# Altium schematic sheet Controller.SchDoc
size A; SheetNumber: 1; SheetTotal: 1
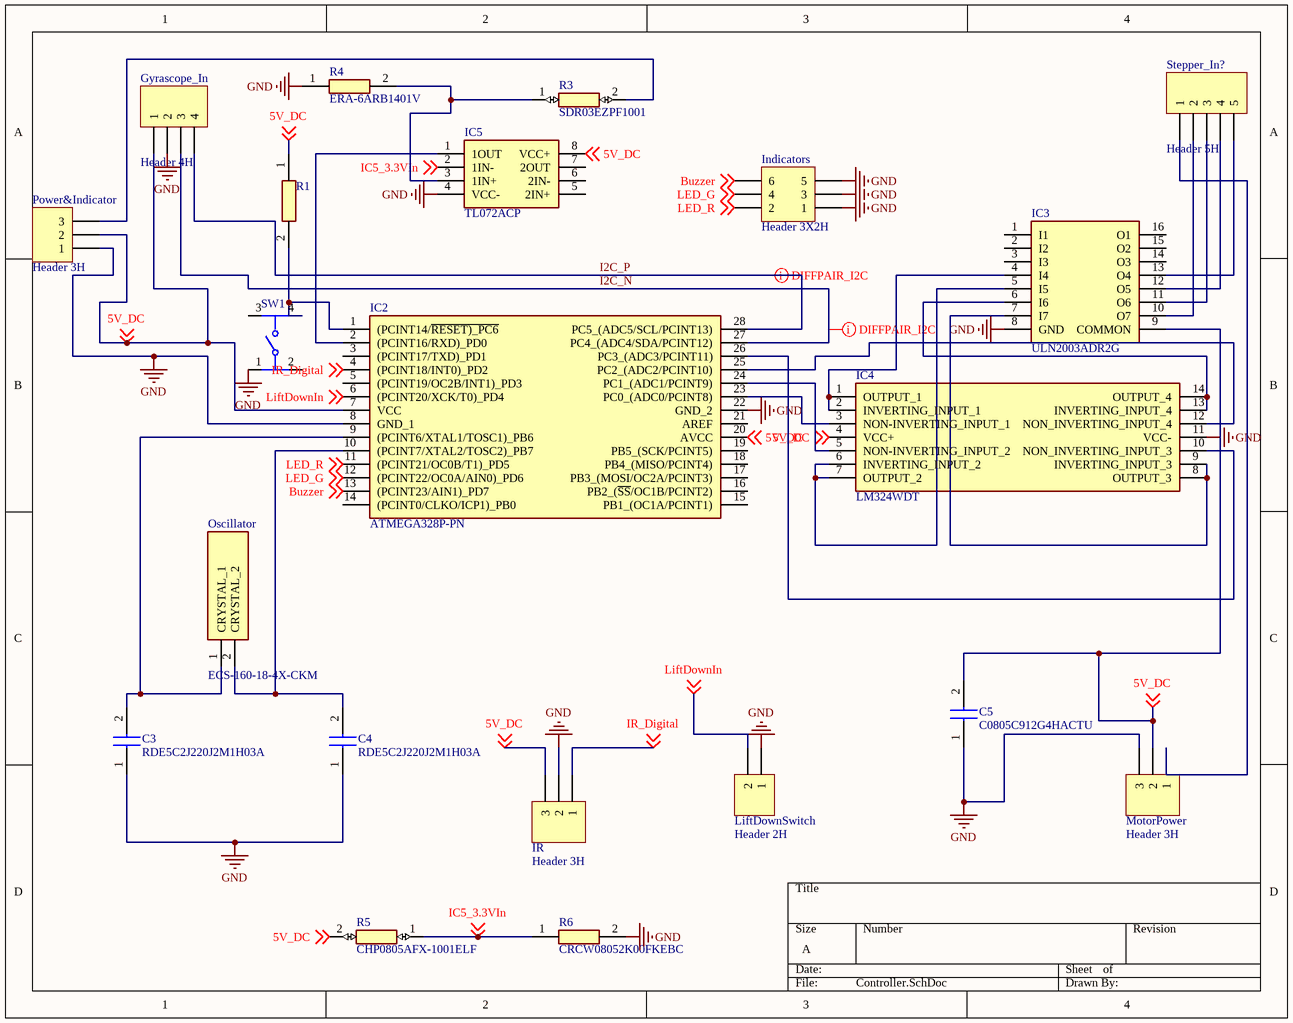
[diagram p0: Controller.SchDoc]

## Parts
C3  RDE5C2J220J2M1H03A  [RCE5C1H104J2A2H03B]
C4  RDE5C2J220J2M1H03A  [RCE5C1H104J2A2H03B]
C5  C0805C912G4HACTU  [CAPC2012X88N]
Gyrascope_In  Header 4H  [HDR1X4H]
IC2  ATMEGA328P-PN  [DIP794W53P254L3467H457Q28N]
IC3  ULN2003ADR2G  [SOIC127P600X175-16N]
IC4  LM324WDT  [SOIC127P600X175-14N]
IC5  TL072ACP  [DIP794W53P254L959H508Q8N]
Indicators  Header 3X2H  [HDR2X3H]
IR  Header 3H  [HDR1X3H]
LiftDownSwitch  Header 2H  [HDR1X2H]
MotorPower  Header 3H  [HDR1X3H]
Oscillator  ECS-160-18-4X-CKM  [ECS160184XCKM]
Power&Indicator  Header 3H  [HDR1X3H]
R1  (no value)  [RESC2012X60N]
R3  SDR03EZPF1001  [RESC1608X55N]
R4  ERA-6ARB1401V  [ERA6A_(0805)]
R5  CHP0805AFX-1001ELF  [RESC2012X60N]
R6  CRCW08052K00FKEBC  [RESC2012X50N]
Stepper_In?  Header 5H  [HDR1X5H]
SW1  (no value)  [FP-2-1825910-6-MFG]

## Nets
GND: C3.1 C4.1 C5.1 Gyrascope_In.2 IC2.8(GND_1) IC2.22(GND_2) IC3.8(GND) IC4.11(VCC-) IC5.4(VCC-) Indicators.1 Indicators.3 Indicators.5 IR.2 LiftDownSwitch.1 MotorPower.3 Power&Indicator.1 R4.1 R6.2 SW1.1
5V_DC: C5.2 Gyrascope_In.1 IC2.7(VCC) IC2.20(AVCC) IC3.9(COMMON) IC4.4(VCC+) IC5.8(VCC+) IR.3 MotorPower.2 Power&Indicator.2 R1.1 R5.2 ; off-sheet 5V_DC
Buzzer: IC2.13((PCINT23/AIN1)_PD7) Indicators.6 ; off-sheet Buzzer
I2C_N: Gyrascope_In.3 IC2.27(PC4_(ADC4/SDA/PCINT12))
I2C_P: Gyrascope_In.4 IC2.28(PC5_(ADC5/SCL/PCINT13))
IC5_3.3VIn: IC5.2(1IN-) R5.1 R6.1 ; off-sheet IC5_3.3VIn
IR_Digital: IC2.4((PCINT18/INT0)_PD2) IR.1 ; off-sheet IR_Digital
LED_G: IC2.12((PCINT22/OC0A/AIN0)_PD6) Indicators.4 ; off-sheet LED_G
LED_R: IC2.11((PCINT21/OC0B/T1)_PD5) Indicators.2 ; off-sheet LED_R
LiftDownIn: IC2.6((PCINT20/XCK/T0)_PD4) LiftDownSwitch.2 ; off-sheet LiftDownIn
NetC3_2: C3.2 IC2.9((PCINT6/XTAL1/TOSC1)_PB6) Oscillator.1(CRYSTAL_1)
NetC4_2: C4.2 IC2.10((PCINT7/XTAL2/TOSC2)_PB7) Oscillator.2(CRYSTAL_2)
NetIC2_1: IC2.1((PCINT14/~{RESET)_PC6}) R1.2 SW1.4
NetIC2_2: IC2.2((PCINT16/RXD)_PD0) IC5.1(1OUT)
NetIC2_23: IC2.23(PC0_(ADC0/PCINT8)) IC4.3(NON-INVERTING_INPUT_1)
NetIC2_24: IC2.24(PC1_(ADC1/PCINT9)) IC4.5(NON-INVERTING_INPUT_2)
NetIC2_25: IC2.25(PC2_(ADC2/PCINT10)) IC4.12(NON_INVERTING_INPUT_4)
NetIC2_26: IC2.26(PC3_(ADC3/PCINT11)) IC4.10(NON_INVERTING_INPUT_3)
NetIC3_4: IC3.4(I4) IC4.1(OUTPUT_1) IC4.2(INVERTING_INPUT_1)
NetIC3_5: IC3.5(I5) IC4.6(INVERTING_INPUT_2) IC4.7(OUTPUT_2)
NetIC3_6: IC3.6(I6) IC4.13(INVERTING_INPUT_4) IC4.14(OUTPUT_4)
NetIC3_7: IC3.7(I7) IC4.8(OUTPUT_3) IC4.9(INVERTING_INPUT_3)
NetIC3_10: IC3.10(O7) Stepper_In?.2
NetIC3_11: IC3.11(O6) Stepper_In?.3
NetIC3_12: IC3.12(O5) Stepper_In?.4
NetIC3_13: IC3.13(O4) Stepper_In?.5
NetIC5_3: IC5.3(1IN+) R3.1 R4.2
NetMotorPower_1: MotorPower.1 Stepper_In?.1
NetPower&Indicator_3: Power&Indicator.3 R3.2

Not connected (* = marked no-connect by the designer): IC2 3((PCINT17/TXD)_PD1) 5((PCINT19/OC2B/INT1)_PD3) 14((PCINT0/CLKO/ICP1)_PB0) 15(PB1_(OC1A/PCINT1)) 16(PB2_(~{SS}/OC1B/PCINT2)) 17(PB3_(MOSI/OC2A/PCINT3)) 18(PB4_(MISO/PCINT4)) 19(PB5_(SCK/PCINT5)) 21(AREF); IC3 1(I1) 2(I2) 3(I3) 14(O3) 15(O2) 16(O1); IC5 5(2IN+) 6(2IN-) 7(2OUT); SW1 2 3

## Layout directives
differential pair; differential pair class I2C: I2C_N, I2C_P

## Library data of the parts
C3 C4 = RDE5C2J220J2M1H03A: Capacitor; Manufacturer_Name: Murata Electronics; Datasheet Link: https://psearch.en.murata.com/capacitor/product/RDE5C2J220J2M1H03A.html; Height: 5.5mm; Manufacturer_Part_Number: RDE5C2J220J2M1H03A; Mouser Part Number: 81-RDE5C2J220J2M1H3A; Mouser Price/Stock: https://www.mouser.co.uk/ProductDetail/Murata-Electronics/RDE5C2J220J2M1H03A?qs=5aG0NVq1C4wmVHtRKJ01XA%3D%3D
C5 = C0805C912G4HACTU: Capacitor; Manufacturer_Name: Kemet; Datasheet Link: https://www.kemet.com/specsheet/C0805C912G4HACTU; Height: 0.88mm; Manufacturer_Part_Number: C0805C912G4HACTU; Mouser Part Number: 80-C0805C912G4HACTU; Mouser Price/Stock: https://www.mouser.co.uk/ProductDetail/KEMET/C0805C912G4HACTU?qs=W0yvOO0ixfHJmyB%252BYCP7IQ%3D%3D
Gyrascope_In = Header 4H: Header, 4-Pin, Right Angle; LatestRevisionDate: 17-Jul-2002; LatestRevisionNote: Re-released for DXP Platform.; Publisher: Altium Limited
IC2 = ATMEGA328P-PN: Integrated Circuit; Manufacturer_Name: Microchip; Datasheet Link: https://datasheet.datasheetarchive.com/originals/distributors/Datasheets_SAMA/81e6b951babeaaddc9de6b0e081ba8bf.pdf; Height: 4.572mm; Manufacturer_Part_Number: ATMEGA328P-PN; Mouser Part Number: 556-ATMEGA328P-PN; Mouser Price/Stock: https://www.mouser.co.uk/ProductDetail/Microchip-Technology-Atmel/ATMEGA328P-PN?qs=6Dg1WZIWLC4IRXxsq4v5tA%3D%3D; Arrow Part Number: ATMEGA328P-PN; Arrow Price/Stock: https://www.arrow.com/en/products/atmega328p-pn/microchip-technology?region=nac
IC3 = ULN2003ADR2G: Integrated Circuit; Manufacturer_Name: ON Semiconductor; Datasheet Link: http://www.onsemi.com/pub/Collateral/ULN2003A-D.PDF; Height: 1.75mm; Manufacturer_Part_Number: ULN2003ADR2G; Mouser Part Number: 863-ULN2003ADR2G; Mouser Price/Stock: https://www.mouser.co.uk/ProductDetail/onsemi/ULN2003ADR2G?qs=t2BMfLoP1KRgd83C6tnDAg%3D%3D; Arrow Part Number: ULN2003ADR2G; Arrow Price/Stock: https://www.arrow.com/en/products/uln2003adr2g/on-semiconductor?region=europe
IC4 = LM324WDT: Integrated Circuit; Manufacturer_Name: STMicroelectronics; Datasheet Link: https://co.mouser.com/datasheet/2/389/lm224a-1849701.pdf; Height: 1.75mm; Manufacturer_Part_Number: LM324WDT; Mouser Part Number: 511-LM324WDT; Mouser Price/Stock: https://www.mouser.co.uk/ProductDetail/STMicroelectronics/LM324WDT?qs=sjzR5wbTsNodE9OFOWodlw%3D%3D
IC5 = TL072ACP: Integrated Circuit; Manufacturer_Name: Texas Instruments; Datasheet Link: http://www.ti.com/lit/ds/symlink/tl071a.pdf; Height: 5.08mm; Manufacturer_Part_Number: TL072ACP; Mouser Part Number: 595-TL072ACP; Mouser Price/Stock: https://www.mouser.co.uk/ProductDetail/Texas-Instruments/TL072ACP?qs=0OT4q4QBUTLFvIZ%252B%2FvrwoQ%3D%3D; Arrow Part Number: TL072ACP; Arrow Price/Stock: https://www.arrow.com/en/products/tl072acp/texas-instruments?region=nac
Indicators = Header 3X2H: Header, 3-Pin, Dual row, Right Angle; LatestRevisionDate: 17-Jul-2002; LatestRevisionNote: Re-released for DXP Platform.; Publisher: Altium Limited
IR MotorPower Power&Indicator = Header 3H: Header, 3-Pin, Right Angle; LatestRevisionDate: 17-Jul-2002; LatestRevisionNote: Re-released for DXP Platform.; Publisher: Altium Limited
LiftDownSwitch = Header 2H: Header, 2-Pin, Right Angle; LatestRevisionDate: 17-Jul-2002; LatestRevisionNote: Re-released for DXP Platform.; Publisher: Altium Limited
Oscillator = ECS-160-18-4X-CKM: Crystal or Oscillator; Manufacturer_Name: ECS; Datasheet Link: https://www.mouser.be/datasheet/2/122/hc-49usx-791.pdf; Height: 3.5mm; Manufacturer_Part_Number: ECS-160-18-4X-CKM; Mouser Part Number: 520-ECS160-18-4X-CKM; Mouser Price/Stock: https://www.mouser.co.uk/ProductDetail/ECS/ECS-160-18-4X-CKM?qs=7MVldsJ5UawYqyimirccKw%3D%3D; Arrow Part Number: ECS-160-18-4X-CKM; Arrow Price/Stock: https://www.arrow.com/en/products/ecs-160-18-4x-ckm/ecs-international?region=nac
R1 = CHP0805-FX-1002ELF: Resistor; Manufacturer_Name: Bourns; Datasheet Link: https://ms.componentsearchengine.com/Datasheets/1/CHP0805-FX-1002ELF.pdf; Height: 0.6mm; Manufacturer_Part_Number: CHP0805-FX-1002ELF; Mouser Part Number: 652-CHP0805FX1002ELF; Mouser Price/Stock: https://www.mouser.co.uk/ProductDetail/Bourns/CHP0805-FX-1002ELF?qs=lc2O%252BfHJPVaDI6gsPdDtfw%3D%3D
R3 = SDR03EZPF1001: Resistor; Manufacturer_Name: ROHM Semiconductor; Datasheet Link: https://mouser.componentsearchengine.com/Datasheets/1/SDR03EZPF1001.pdf; Height: 0.55mm; Manufacturer_Part_Number: SDR03EZPF1001; Mouser Part Number: 755-SDR03EZPF1001; Mouser Price/Stock: https://www.mouser.co.uk/ProductDetail/ROHM-Semiconductor/SDR03EZPF1001?qs=byeeYqUIh0NXXxDsimC7bA%3D%3D
R4 = ERA-6ARB1401V: Resistor; Manufacturer_Name: Panasonic; Datasheet Link: http://industrial.panasonic.com/cdbs/www-data/pdf/RDM0000/AOA0000C307.pdf; Height: 0.6mm; Manufacturer_Part_Number: ERA-6ARB1401V; Mouser Part Number: 667-ERA-6ARB1401V; Mouser Price/Stock: https://www.mouser.com/Search/Refine.aspx?Keyword=667-ERA-6ARB1401V
R5 = CHP0805AFX-1001ELF: Resistor; Manufacturer_Name: Bourns; Datasheet Link: https://www.mouser.com/datasheet/2/54/chp-a-1858677.pdf; Height: 0.6mm; Manufacturer_Part_Number: CHP0805AFX-1001ELF; Mouser Part Number: 652-CHP0805AFX1001EL; Mouser Price/Stock: https://www.mouser.co.uk/ProductDetail/Bourns/CHP0805AFX-1001ELF?qs=BJlw7L4Cy7%2F%2FdiZX3l7oWQ%3D%3D; Arrow Part Number: CHP0805AFX-1001ELF; Arrow Price/Stock: https://www.arrow.com/en/products/chp0805afx-1001elf/bourns?region=nac
R6 = CRCW08052K00FKEBC: Resistor; Manufacturer_Name: Vishay; Datasheet Link: https://www.arrow.com/en/products/crcw08052k00fkebc/vishay?region=nac; Height: 0.5mm; Manufacturer_Part_Number: CRCW08052K00FKEBC; Mouser Part Number: 71-CRCW08052K00FKEBC; Mouser Price/Stock: https://www.mouser.co.uk/ProductDetail/Vishay-Dale/CRCW08052K00FKEBC?qs=wd5RIQLrsJimvZ2z7rs9jQ%3D%3D; Arrow Part Number: CRCW08052K00FKEBC; Arrow Price/Stock: https://www.arrow.com/en/products/crcw08052k00fkebc/vishay?region=nac
Stepper_In? = Header 5H: Header, 5-Pin, Right Angle; LatestRevisionDate: 17-Jul-2002; LatestRevisionNote: Re-released for DXP Platform.; Publisher: Altium Limited
SW1 = CMP-03407-000025-1: SWITCH TACTILE SPST-NO 0.05A 24V; Max Current Rating: 50mA; Actuator Type: Standard; Illumination Type: Non-Illuminated; Actuator Material: Nylon; Throw Configuration: SPST; Actuator Length: 0.37inch; Operating Force: 100gf; Switch Function: Off-Mom; Mechanical Life: 100000Cycles; Actuator Color: Brown; Switch Travel: 0.25mm; Packaging: Loose Piece; Series: FSMJ; RoHS Compliant: Yes; Mount: Through Hole; Lead Free: Lead Free; Length: 5.99mm; Voltage Rating (DC): 24V; Type: Switch; Contact Current Rating: 50mA; Contact Material: Copper Alloy; Max Operating Temperature: 85°C; Min Operating Temperature: -35°C; Termination: PC Pin; ELV: Compliant; Orientation: Straight; Contact Plating: Silver